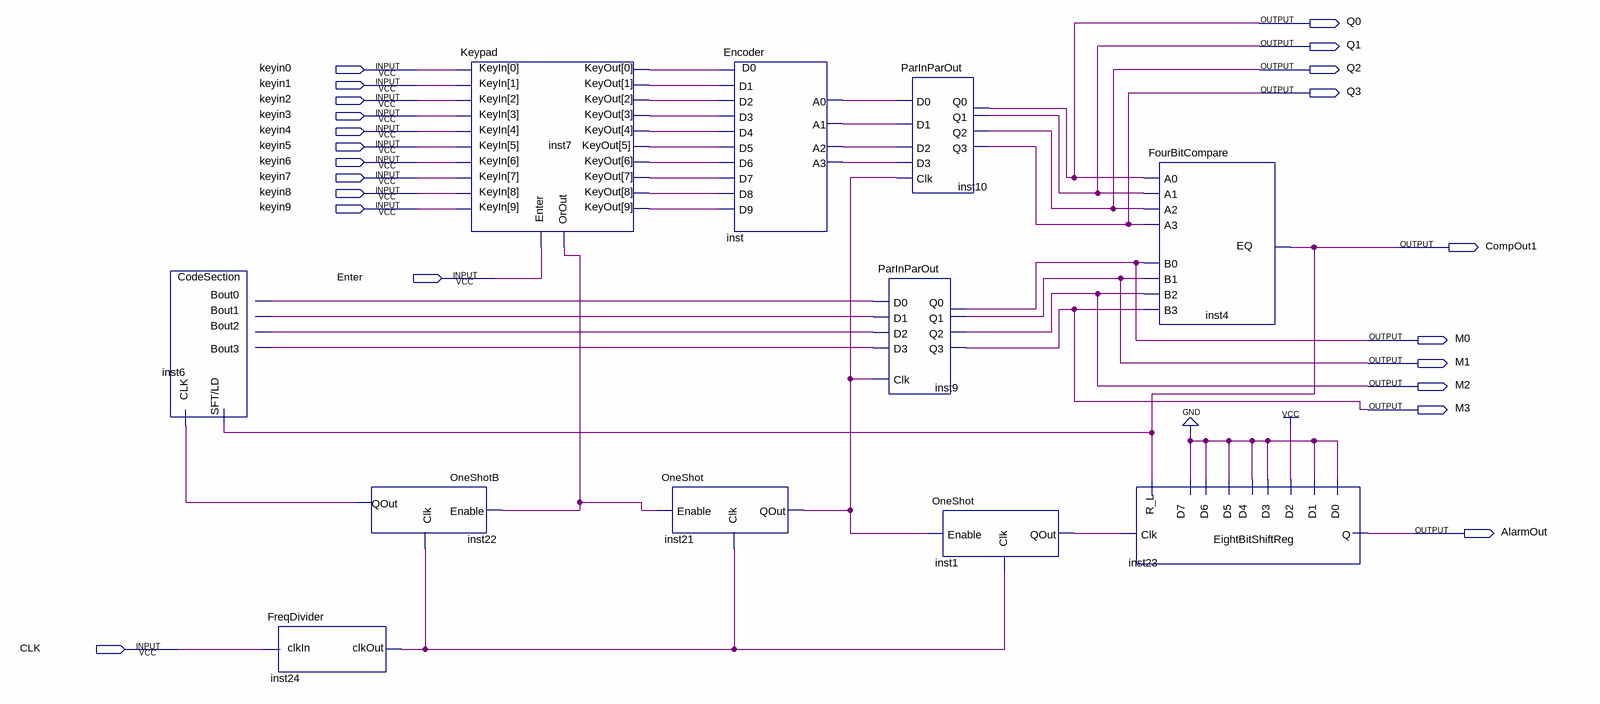
[diagram p0: schematic sheet]
// Quartus schematic AlarmSystem.bdf as structural Verilog: 11 symbols, 22 pins
module AlarmSystem (
  input  keyin0,
  input  keyin1,
  input  keyin2,
  input  keyin3,
  input  keyin4,
  input  keyin5,
  input  keyin6,
  input  keyin7,
  input  keyin8,
  input  keyin9,
  input  Enter,
  input  CLK,
  output Q0,
  output Q1,
  output Q2,
  output Q3,
  output CompOut1,
  output M0,
  output M1,
  output M2,
  output M3,
  output AlarmOut
);

  wire inst1_qout, inst6_bout0, inst6_bout1, inst6_bout2, inst6_bout3, inst7_keyout, inst7_keyout_2,
       inst7_keyout_3, inst7_keyout_4, inst7_keyout_5, inst7_keyout_6, inst7_keyout_7, inst7_keyout_8,
       inst7_keyout_9, inst7_keyout_10, inst7_orout, inst21_qout, inst22_qout, inst24_clkout, inst_a0,
       inst_a1, inst_a2, inst_a3;

  CodeSection inst6 (
    .CLK(inst22_qout), .\SFT/LD (CompOut1), .Bout1(inst6_bout1), .Bout0(inst6_bout0), .Bout2(inst6_bout2),
    .Bout3(inst6_bout3));
  FreqDivider inst24 (.clkIn(CLK), .clkOut(inst24_clkout));
  OneShotB inst22 (.Enable(inst7_orout), .Clk(inst24_clkout), .QOut(inst22_qout));
  Keypad inst7 (
    .Enter(Enter), .KeyIn({keyin9, keyin8, keyin7, keyin6, keyin5, keyin4, keyin3, keyin2, keyin1, keyin0}),
    .OrOut(inst7_orout),
    .KeyOut({inst7_keyout_10, inst7_keyout_9, inst7_keyout_8, inst7_keyout_7, inst7_keyout_6, inst7_keyout_5, inst7_keyout_4, inst7_keyout_3, inst7_keyout_2, inst7_keyout}));
  OneShot inst21 (.Enable(inst7_orout), .Clk(inst24_clkout), .QOut(inst21_qout));
  Encoder inst (
    .D1(inst7_keyout_2), .D2(inst7_keyout_3), .D3(inst7_keyout_4), .D4(inst7_keyout_5), .D5(inst7_keyout_6),
    .D6(inst7_keyout_7), .D7(inst7_keyout_8), .D8(inst7_keyout_9), .D9(inst7_keyout_10), .D0(inst7_keyout),
    .A0(inst_a0), .A1(inst_a1), .A2(inst_a2), .A3(inst_a3));
  ParInParOut inst9 (
    .D3(inst6_bout3), .D2(inst6_bout2), .D1(inst6_bout1), .D0(inst6_bout0), .Clk(inst21_qout), .Q3(M3),
    .Q2(M2), .Q1(M1), .Q0(M0));
  ParInParOut inst10 (
    .D3(inst_a3), .D2(inst_a2), .D1(inst_a1), .D0(inst_a0), .Clk(inst21_qout), .Q3(Q3), .Q2(Q2), .Q1(Q1),
    .Q0(Q0));
  OneShot inst1 (.Enable(inst21_qout), .Clk(inst24_clkout), .QOut(inst1_qout));
  EightBitShiftReg inst23 (
    .Clk(inst1_qout), .D7(1'b0), .D6(1'b0), .D5(1'b0), .D4(1'b0), .D3(1'b0), .D2(1'b1), .D1(1'b0), .D0(1'b0),
    .R_L(CompOut1), .Q(AlarmOut));
  FourBitCompare inst4 (.A0(Q0), .A1(Q1), .A2(Q2), .A3(Q3), .B0(M0), .B1(M1), .B2(M2), .B3(M3), .EQ(CompOut1));
endmodule
